# EAGLE design TimerModule (EAGLE 9.6.2)
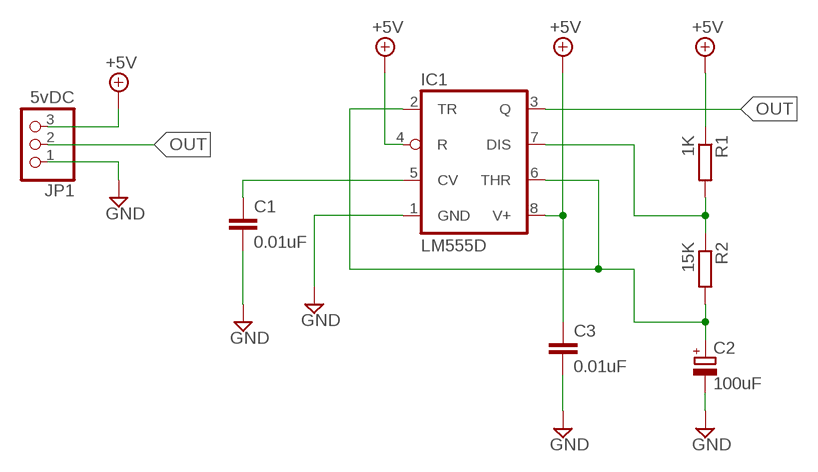
[diagram p0: schematic, sheet 1]

## Parts
C1  0.01uF  C-EUC0805  [C0805]
C2  100uF  CPOL-EUE2.5-5  [E2,5-5]
C3  0.01uF  C-EUC0805  [C0805]
IC1  LM555D  [SO08]
JP1  5vDC  PINHD-1X3  [1X03]
R1  1K  R-EU_M0805  [M0805]
R2  15K  R-EU_M0805  [M0805]

## Nets
+5V: C3.1 IC1.4(R) IC1.8(V+) JP1.3 R1.1
GND: C1.2 C2.- C3.2 IC1.1(GND) JP1.1
N$1: C1.1 IC1.5(CV)
N$2: IC1.7(DIS) R1.2 R2.1
N$3: C2.+ IC1.2(TR) IC1.6(THR) R2.2
OUT: IC1.3(Q) JP1.2

## Library data of the parts
C1 C3 = rcl:C-EU: CAPACITOR, European symbol; SPICEPREFIX: C
C2 = rcl:CPOL-EU: POLARIZED CAPACITOR, European symbol; SPICEPREFIX: C
IC1 = linear:*555: TIMER
JP1 = pinhead:PINHD-1X3: PIN HEADER
R1 R2 = rcl:R-EU_: RESISTOR, European symbol; SPICEPREFIX: R

## Board
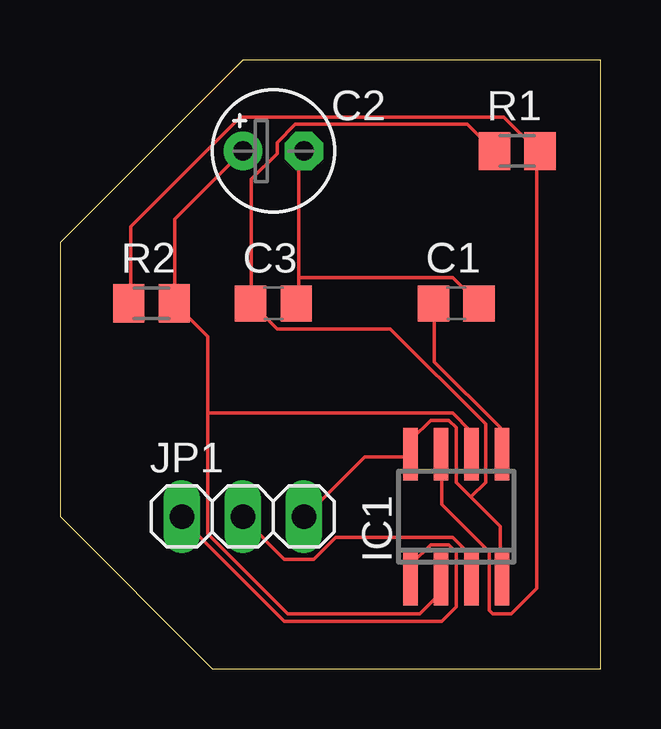
[diagram p1: board, top side]
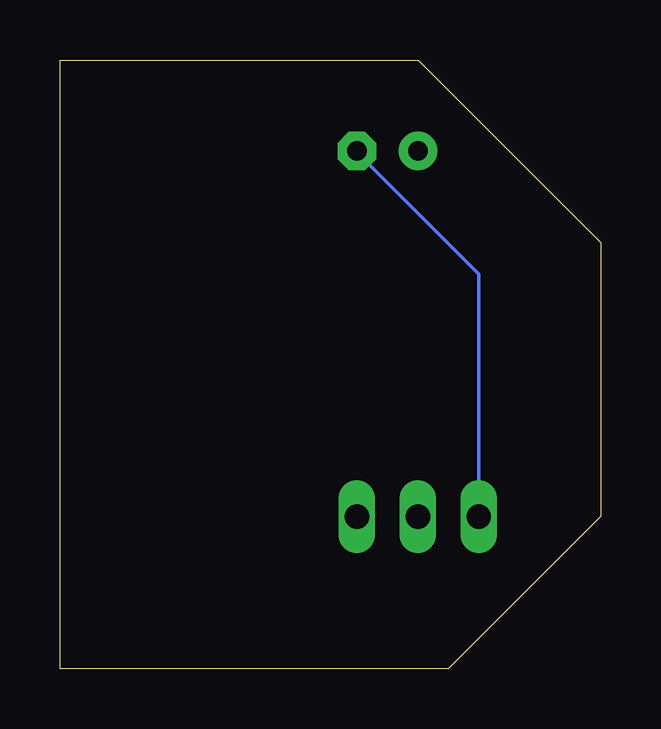
[diagram p2: board, bottom side, seen from below]

Size 22.53 x 25.39 mm. Coordinates in mm from the lower left corner, seen from the top.
Outline: 0,17.78 0,6.35 6.35,0 22.53,0 22.53,25.39 7.61,25.39 0,17.78
Copper layers (1*16): Top 0.035mm / dielectric 1.5mm / Bottom 0.035mm
Design rules "default": minimum track width 6mil, minimum drill 0.35mm, track to track 6mil, track to pad 6mil, pad to pad 6mil, via to via 6mil, smd to smd 6mil, copper to edge 40mil, drill to drill 6mil, minimum pad ring 10mil, minimum via ring 8mil, stop-mask expansion 4mil, vias tented up to drill 0mil, thermal gap 10mil

### Footprints (pad centres in the part's own frame; a part is rotated, then mirrored left to right if it is on the bottom)
C0805 = smd 1.3 x 1.5: 1 -0.95,0; 2 0.95,0
E2,5-5 = drill 0.813 pad 1.6: + -1.27,0 | drill 0.813 pad 1.6 octagon: - 1.27,0
SO08 = smd 0.6 x 2.2: 1 -1.905,-2.6; 2 -0.635,-2.6; 3 0.635,-2.6; 4 1.905,-2.6; 5 1.905,2.6; 6 0.635,2.6; 7 -0.635,2.6; 8 -1.905,2.6
1X03 = drill 1.016 long: 1 -2.54,0; 2 0,0; 3 2.54,0
M0805 = smd 1.3 x 1.6: 1 -0.95,0; 2 0.95,0

### Placement (x,y rotation side)
C1  16.51,15.24 0 top
C2  8.89,21.59 0 top
C3  8.89,15.24 0 top
IC1  16.51,6.35 0 top
JP1  7.62,6.35 0 top
R1  19.05,21.59 0 top
R2  3.81,15.24 0 top

### Tracks (layer width: path | path; a pad name or v marks a point on that pad's centre or on a via)
+5V
  Top 0.152: JP1.3 10.26,6.4 12.7,8.84 14.53,8.84 IC1.8 14.68,8.99 14.68,9.6 15.44,10.36 16.2,10.36 16.51,10.06 16.51,7.77 17.12,7.16 | 17.12,7.16 18.34,5.94 18.34,3.81 IC1.4 | 7.98,15.24 7.98,20.42 9.04,21.49 9.04,21.95 9.8,22.71 16.97,22.71 18.03,21.64 R1.1 | 17.12,7.16 17.73,7.77 17.73,10.21 13.77,14.17 9.04,14.17 7.98,15.24 | 7.98,15.24 C3.1
GND
  Top 0.152: IC1.1 14.68,3.81 14.68,4.42 15.44,5.18 16.2,5.18 16.51,4.88 16.51,2.59 15.9,1.98 9.35,1.98 5.08,6.25 JP1.1 | 9.96,16.31 9.96,21.34 10.11,21.49 C2.- | 9.96,16.31 9.96,15.24 C3.2 | 9.96,16.31 16.36,16.31 17.42,15.24 C1.2
  Bottom 0.152: JP1.1 5.08,16.46 10.11,21.49 C2.-
N$1
  Top 0.152: C1.1 15.6,15.24 15.6,12.8 18.34,10.06 18.34,8.99 IC1.5
N$2
  Top 0.152: R2.1 2.95,15.24 2.95,18.44 7.52,23.01 18.49,23.01 19.86,21.64 R1.2 19.86,21.49 19.86,3.35 18.8,2.29 18.03,2.29 17.88,2.44 17.88,4.88 15.9,6.86 15.9,8.84 IC1.7
N$3
  Top 0.152: 4.77,15.24 4.77,18.74 C2.+ | 6.15,10.67 6.15,13.87 4.77,15.24 | 6.15,10.67 6.15,5.64 9.5,2.29 14.99,2.29 15.75,3.05 15.75,3.66 IC1.2 | 4.77,15.24 R2.2 | 6.15,10.67 16.36,10.67 17.12,9.91 17.12,8.99 IC1.6
OUT
  Top 0.152: IC1.3 17.12,3.81 17.12,4.72 16.36,5.49 11.48,5.49 10.57,4.57 9.35,4.57 7.67,6.25 JP1.2